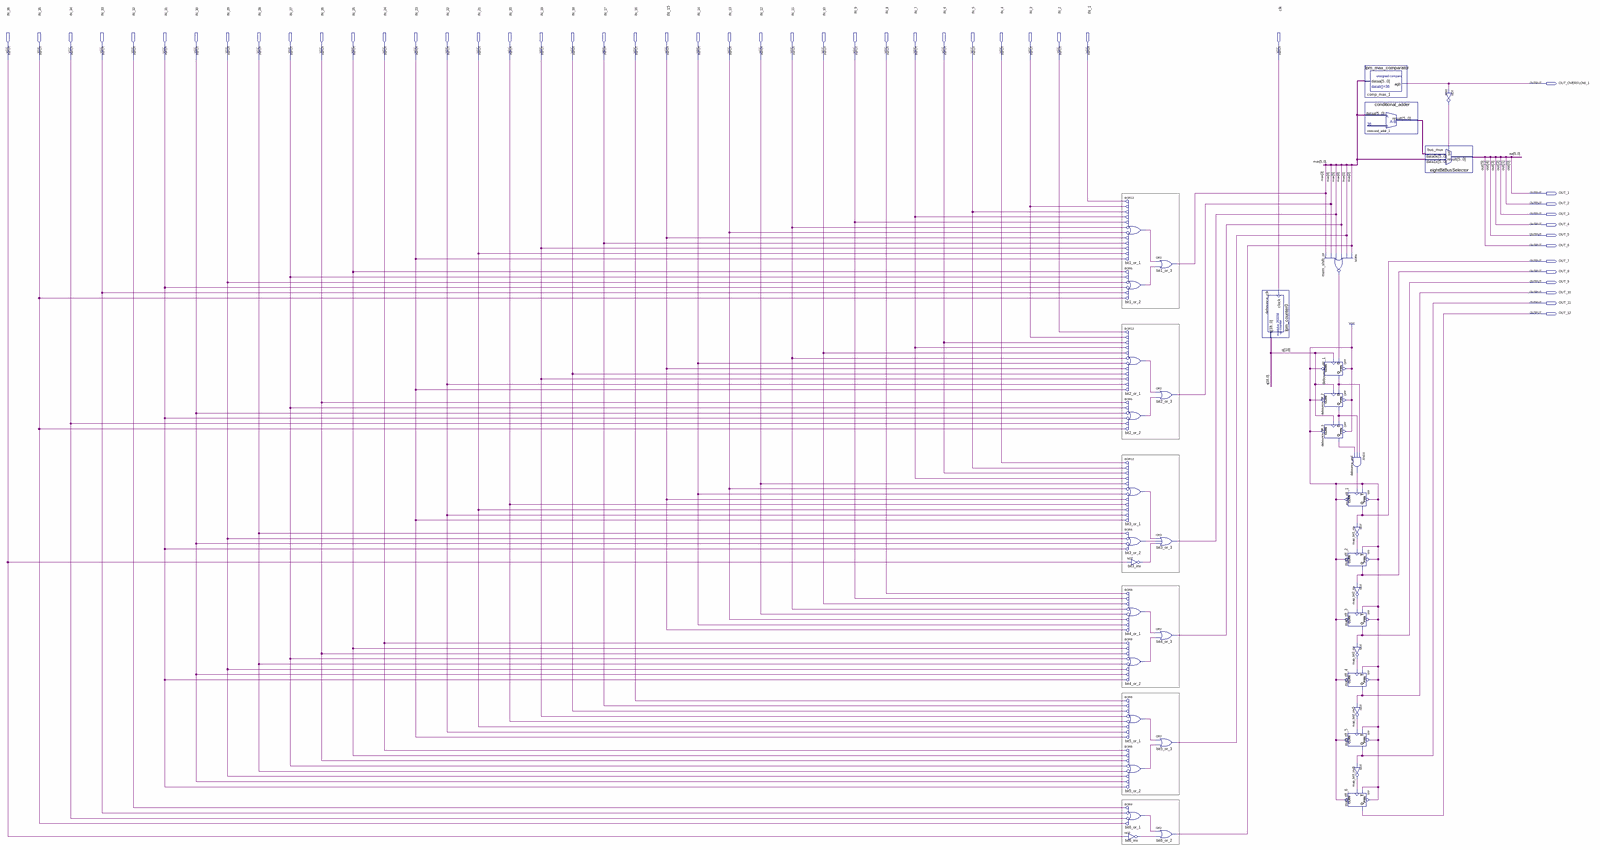
[diagram p0: schematic sheet, whole]
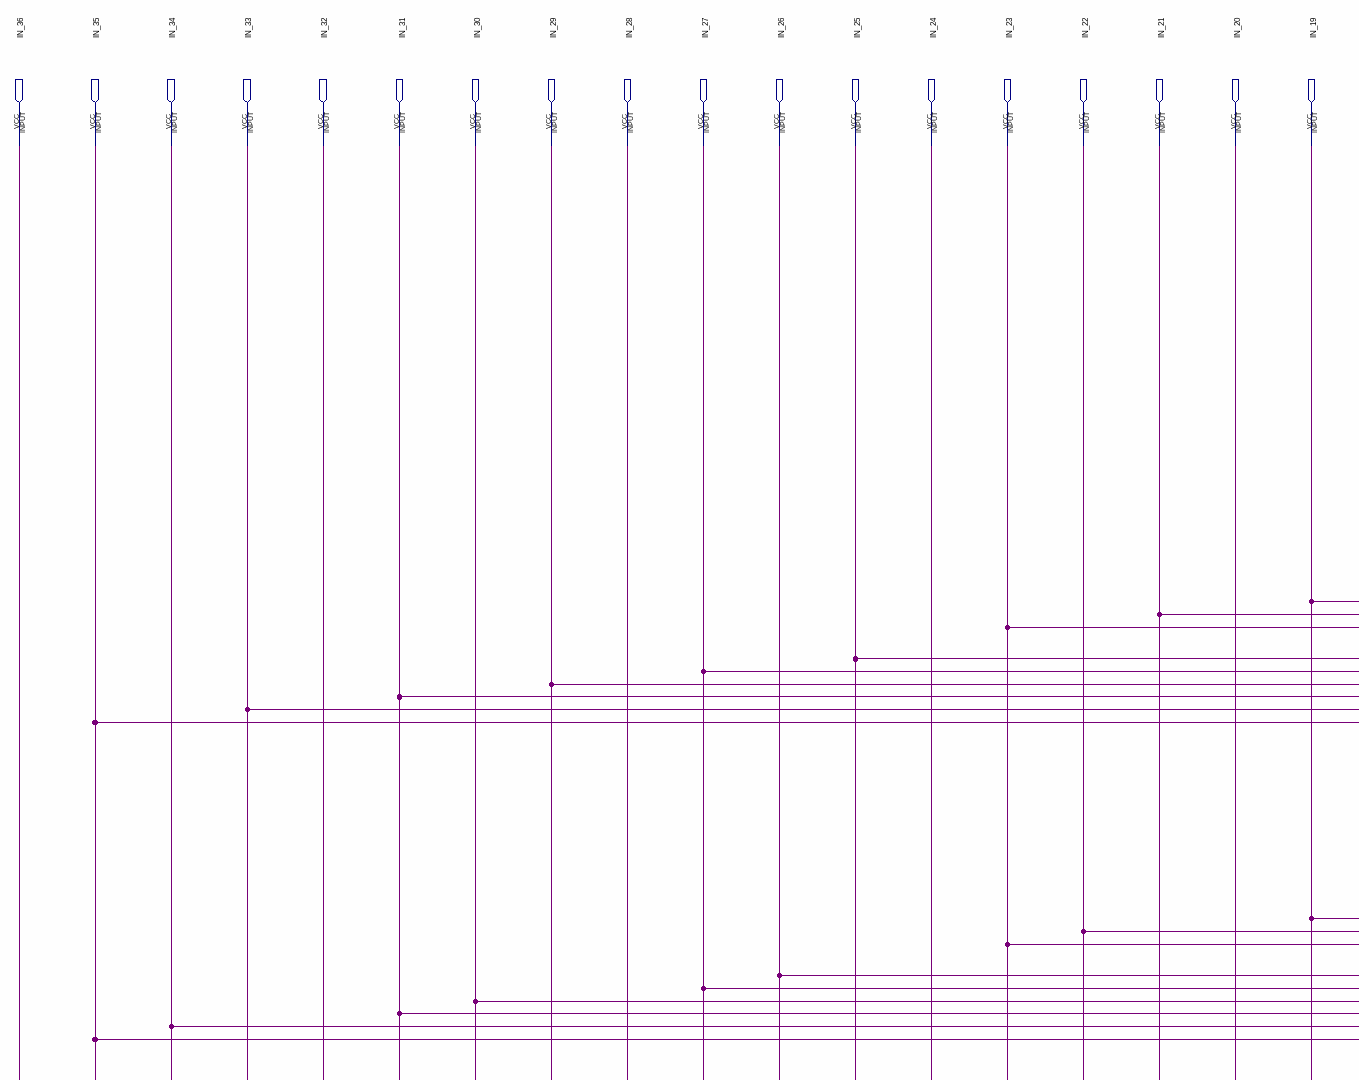
[diagram p1: schematic sheet, upper left part]
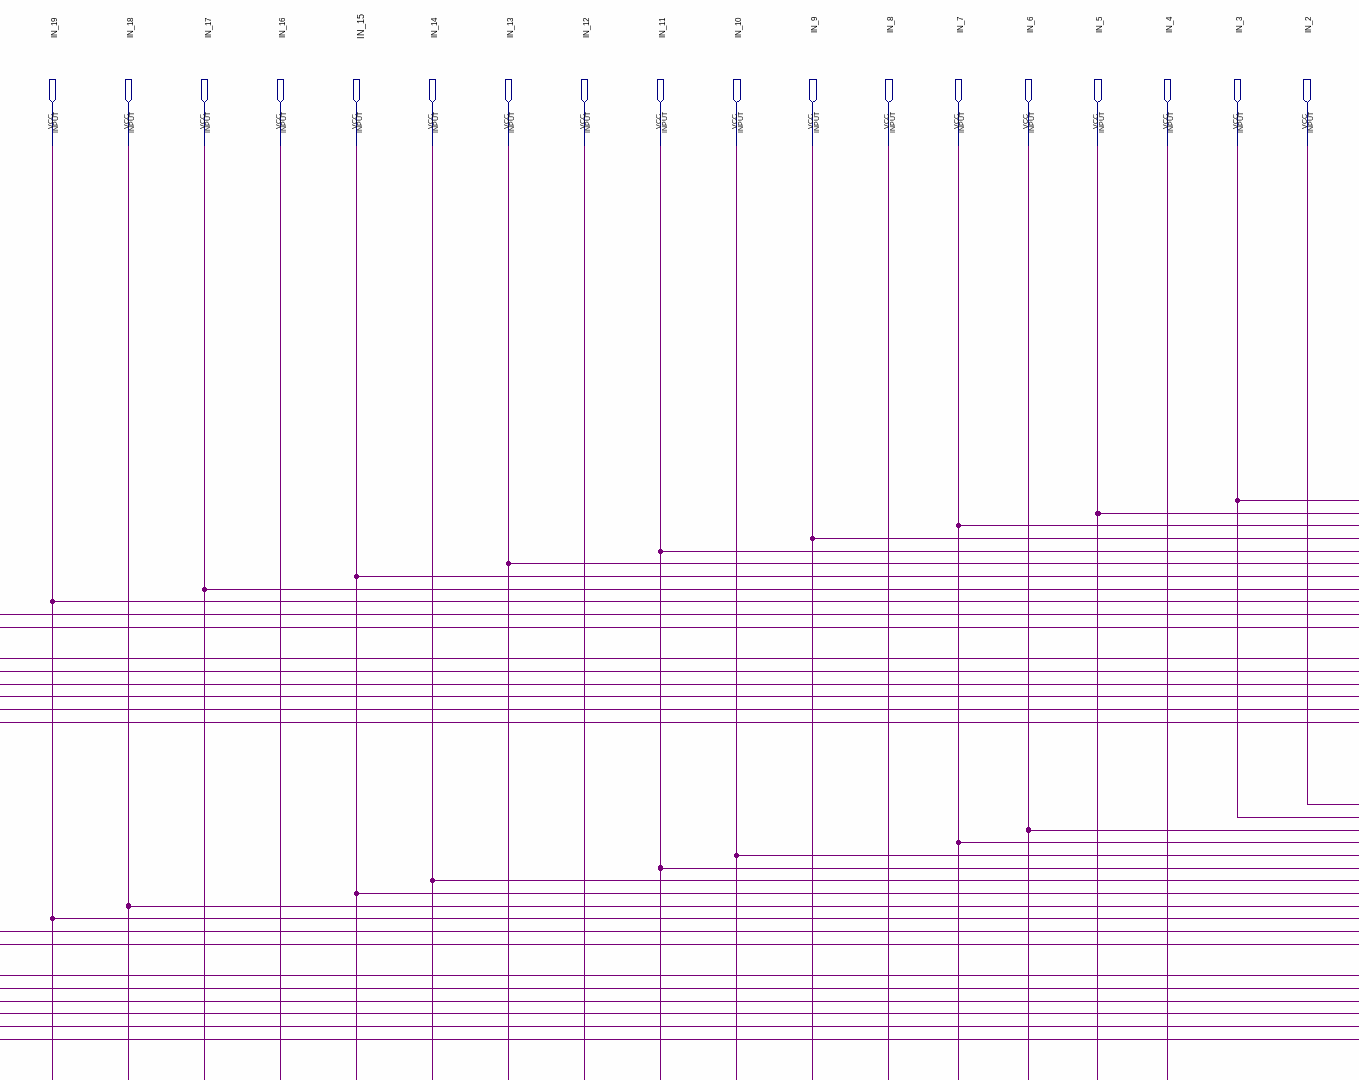
[diagram p2: schematic sheet, upper centre part]
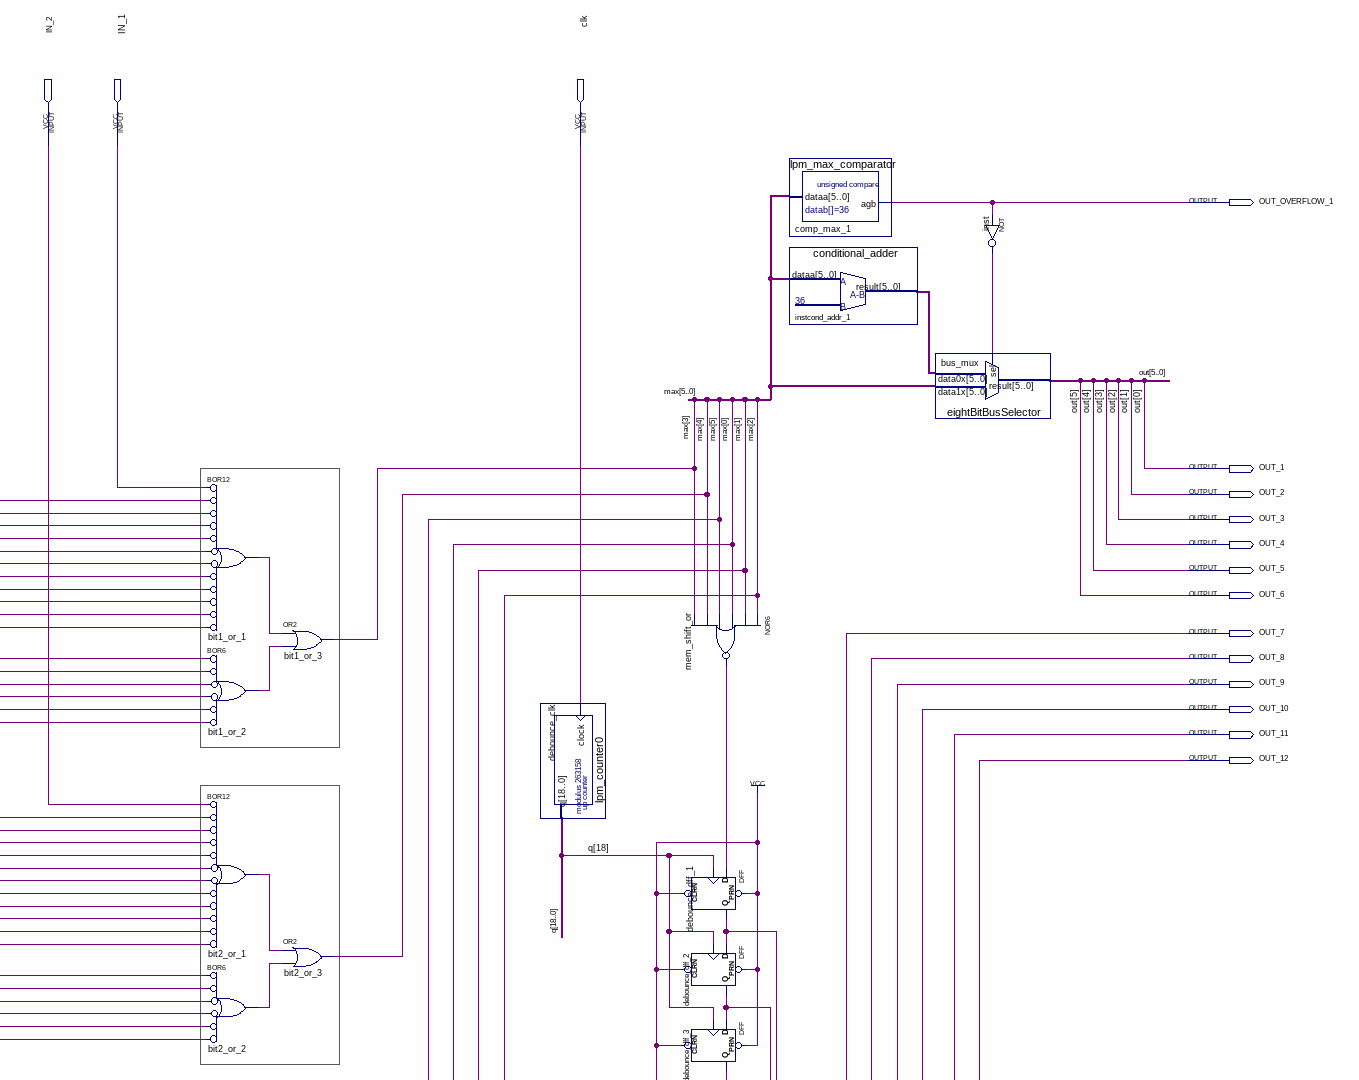
[diagram p3: schematic sheet, upper right part]
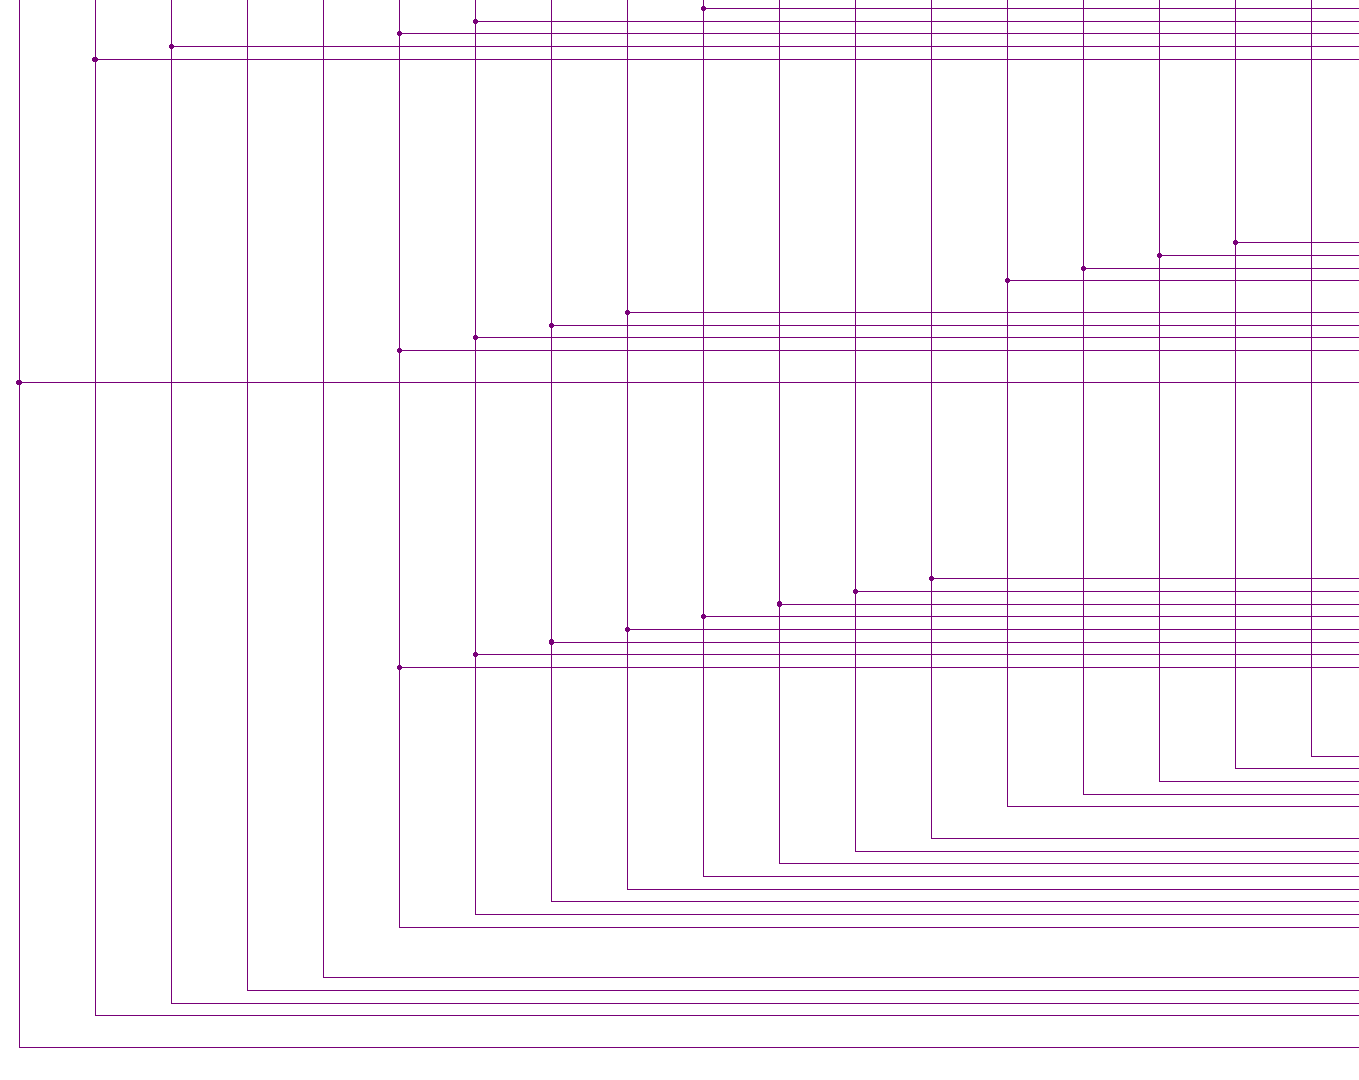
[diagram p4: schematic sheet, lower left part]
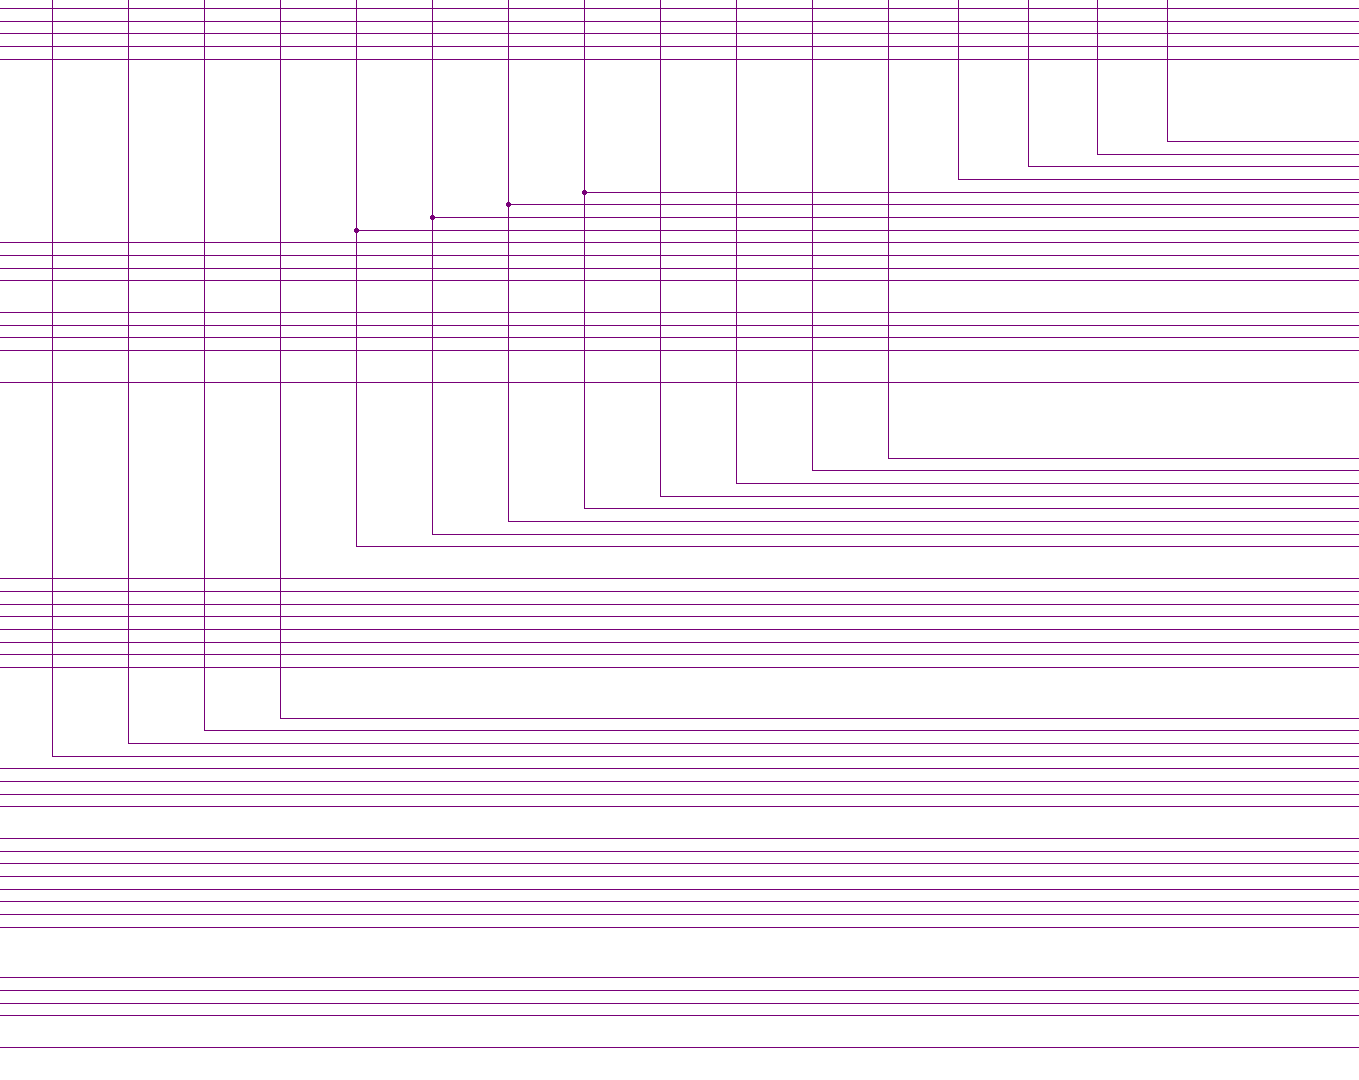
[diagram p5: schematic sheet, lower centre part]
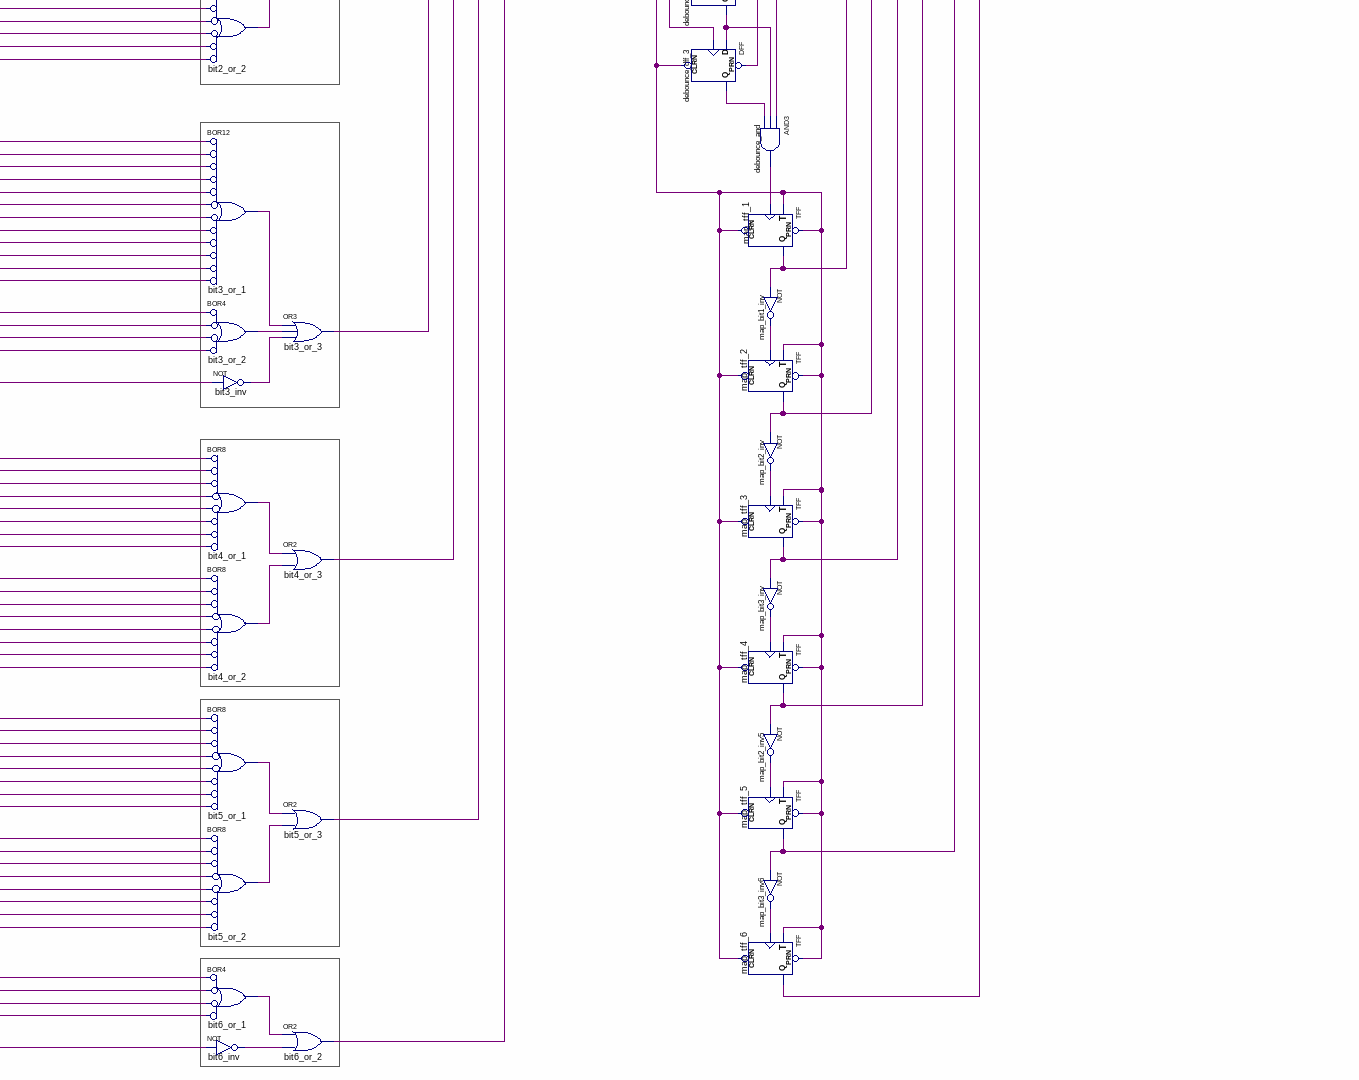
[diagram p6: schematic sheet, lower right part]
// Quartus schematic mux_rom_demux.bdf as structural Verilog: 40 symbols, 50 pins
module mux_rom_demux (
  input  IN_36,
  input  IN_35,
  input  IN_34,
  input  IN_33,
  input  IN_32,
  input  IN_31,
  input  IN_30,
  input  IN_29,
  input  IN_28,
  input  IN_27,
  input  IN_26,
  input  IN_25,
  input  IN_24,
  input  IN_23,
  input  IN_22,
  input  IN_21,
  input  IN_20,
  input  IN_19,
  input  IN_18,
  input  IN_17,
  input  IN_16,
  input  IN_15,
  input  IN_14,
  input  IN_13,
  input  IN_12,
  input  IN_11,
  input  IN_10,
  input  IN_9,
  input  IN_8,
  input  IN_7,
  input  IN_6,
  input  IN_5,
  input  IN_4,
  input  IN_3,
  input  IN_2,
  input  IN_1,
  input  clk,
  output OUT_OVERFLOW_1,
  output OUT_1,
  output OUT_2,
  output OUT_3,
  output OUT_4,
  output OUT_5,
  output OUT_6,
  output OUT_7,
  output OUT_8,
  output OUT_9,
  output OUT_10,
  output OUT_11,
  output OUT_12
);

  wire bit1_or_1_out, bit1_or_2_out, bit2_or_1_out, bit2_or_2_out, bit3_inv_out, bit3_or_1_out,
       bit3_or_2_out, bit4_or_1_out, bit4_or_2_out, bit5_or_1_out, bit5_or_2_out, bit6_inv_out,
       bit6_or_1_out, debounce_and_out, debounce_dff_1_q, debounce_dff_2_q, debounce_dff_3_q, inst_out,
       map_bit1_inv_out, map_bit2_inv5_out, map_bit2_inv_out, map_bit3_inv6_out, map_bit3_inv_out,
       mem_shift_or_out;
  wire [5:0] instcond_addr_1_result, max;
  wire [18:0] q;

  or bit1_or_1 (bit1_or_1_out, ~IN_1, ~IN_3, ~IN_5, ~IN_7, ~IN_9, ~IN_11, ~IN_13, ~IN_15, ~IN_17, ~IN_19, ~IN_21, ~IN_23);  // BOR12
  or bit1_or_2 (bit1_or_2_out, ~IN_25, ~IN_27, ~IN_29, ~IN_31, ~IN_33, ~IN_35);  // BOR6
  or bit2_or_1 (bit2_or_1_out, ~IN_2, ~IN_3, ~IN_6, ~IN_7, ~IN_10, ~IN_11, ~IN_14, ~IN_15, ~IN_18, ~IN_19, ~IN_22, ~IN_23);  // BOR12
  or bit2_or_2 (bit2_or_2_out, ~IN_26, ~IN_27, ~IN_30, ~IN_31, ~IN_34, ~IN_35);  // BOR6
  or bit3_or_1 (bit3_or_1_out, ~IN_4, ~IN_5, ~IN_6, ~IN_7, ~IN_12, ~IN_13, ~IN_14, ~IN_15, ~IN_20, ~IN_21, ~IN_22, ~IN_23);  // BOR12
  or bit3_or_2 (bit3_or_2_out, ~IN_28, ~IN_29, ~IN_30, ~IN_31);  // BOR4
  or bit4_or_1 (bit4_or_1_out, ~IN_8, ~IN_9, ~IN_10, ~IN_11, ~IN_12, ~IN_13, ~IN_14, ~IN_15);  // BOR8
  or bit4_or_2 (bit4_or_2_out, ~IN_24, ~IN_25, ~IN_26, ~IN_27, ~IN_28, ~IN_29, ~IN_30, ~IN_31);  // BOR8
  or bit5_or_1 (bit5_or_1_out, ~IN_16, ~IN_17, ~IN_18, ~IN_19, ~IN_20, ~IN_21, ~IN_22, ~IN_23);  // BOR8
  or bit5_or_2 (bit5_or_2_out, ~IN_24, ~IN_25, ~IN_26, ~IN_27, ~IN_28, ~IN_29, ~IN_30, ~IN_31);  // BOR8
  or bit6_or_1 (bit6_or_1_out, ~IN_32, ~IN_33, ~IN_34, ~IN_35);  // BOR4
  not bit6_inv (bit6_inv_out, IN_36);
  not bit3_inv (bit3_inv_out, IN_36);
  or bit1_or_3 (max[3], bit1_or_1_out, bit1_or_2_out);
  or bit2_or_3 (max[4], bit2_or_1_out, bit2_or_2_out);
  or bit3_or_3 (max[5], bit3_or_1_out, bit3_or_2_out, bit3_inv_out);
  or bit4_or_3 (max[0], bit4_or_1_out, bit4_or_2_out);
  or bit5_or_3 (max[1], bit5_or_1_out, bit5_or_2_out);
  or bit6_or_2 (max[2], bit6_or_1_out, bit6_inv_out);
  lpm_counter0 debounce_clk (.clock(clk), .q(q));
  nor mem_shift_or (mem_shift_or_out, max[2], max[1], max[0], max[5], max[4], max[3]);
  DFF debounce_dff_1 (.CLRN(1'b1), .CLK(q[18]), .D(mem_shift_or_out), .PRN(1'b1), .Q(debounce_dff_1_q));
  DFF debounce_dff_2 (.CLRN(1'b1), .CLK(q[18]), .D(debounce_dff_1_q), .PRN(1'b1), .Q(debounce_dff_2_q));
  DFF debounce_dff_3 (.CLRN(1'b1), .CLK(q[18]), .D(debounce_dff_2_q), .PRN(1'b1), .Q(debounce_dff_3_q));
  and debounce_and (debounce_and_out, debounce_dff_1_q, debounce_dff_2_q, debounce_dff_3_q);
  TFF map_tff_1 (.PRN(1'b1), .CLRN(1'b1), .T(1'b1), .CLK(debounce_and_out), .Q(OUT_7));
  not map_bit1_inv (map_bit1_inv_out, OUT_7);
  TFF map_tff_2 (.PRN(1'b1), .CLRN(1'b1), .T(1'b1), .CLK(map_bit1_inv_out), .Q(OUT_8));
  not map_bit2_inv (map_bit2_inv_out, OUT_8);
  TFF map_tff_3 (.PRN(1'b1), .CLRN(1'b1), .T(1'b1), .CLK(map_bit2_inv_out), .Q(OUT_9));
  not map_bit3_inv (map_bit3_inv_out, OUT_9);
  TFF map_tff_4 (.PRN(1'b1), .CLRN(1'b1), .T(1'b1), .CLK(map_bit3_inv_out), .Q(OUT_10));
  not map_bit2_inv5 (map_bit2_inv5_out, OUT_10);
  TFF map_tff_5 (.PRN(1'b1), .CLRN(1'b1), .T(1'b1), .CLK(map_bit2_inv5_out), .Q(OUT_11));
  not map_bit3_inv6 (map_bit3_inv6_out, OUT_11);
  TFF map_tff_6 (.PRN(1'b1), .CLRN(1'b1), .T(1'b1), .CLK(map_bit3_inv6_out), .Q(OUT_12));
  lpm_max_comparator comp_max_1 (.dataa(max), .agb(OUT_OVERFLOW_1));
  conditional_adder instcond_addr_1 (.dataa(max), .result(instcond_addr_1_result));
  eightBitBusSelector bus_mux (
    .data1x(max), .data0x(instcond_addr_1_result), .sel(inst_out),
    .result({OUT_6, OUT_5, OUT_4, OUT_3, OUT_2, OUT_1}));
  not inst (inst_out, OUT_OVERFLOW_1);

  // Other names for the same wires on the sheet: out[5:0] = {OUT_6, OUT_5, OUT_4, OUT_3, OUT_2, OUT_1}
endmodule
